# Altium schematic sheet design_11.SchDoc: design
size 414 x 279 mm; Date: 1/25/2021 11:39:22 PM; SheetNumber: 12; Origin: Eagle; GateName_1: G$1; SymbolName_1: A3-L-GUMSTIX; LibraryName: qualified_1; DeviceSetName: A3-L-GUMSTIX; A: A; B: B; C: C; D: D; E: E; F: F; G: G; H: H; 1: 1; 2: 2; 3: 3; 4: 4; 5: 5; Sheet: Sheet:; C:/Gumstix/gumstix-logo-16.bmp: C:/Gumstix/gumstix-logo-16.bmp; Board: Board:
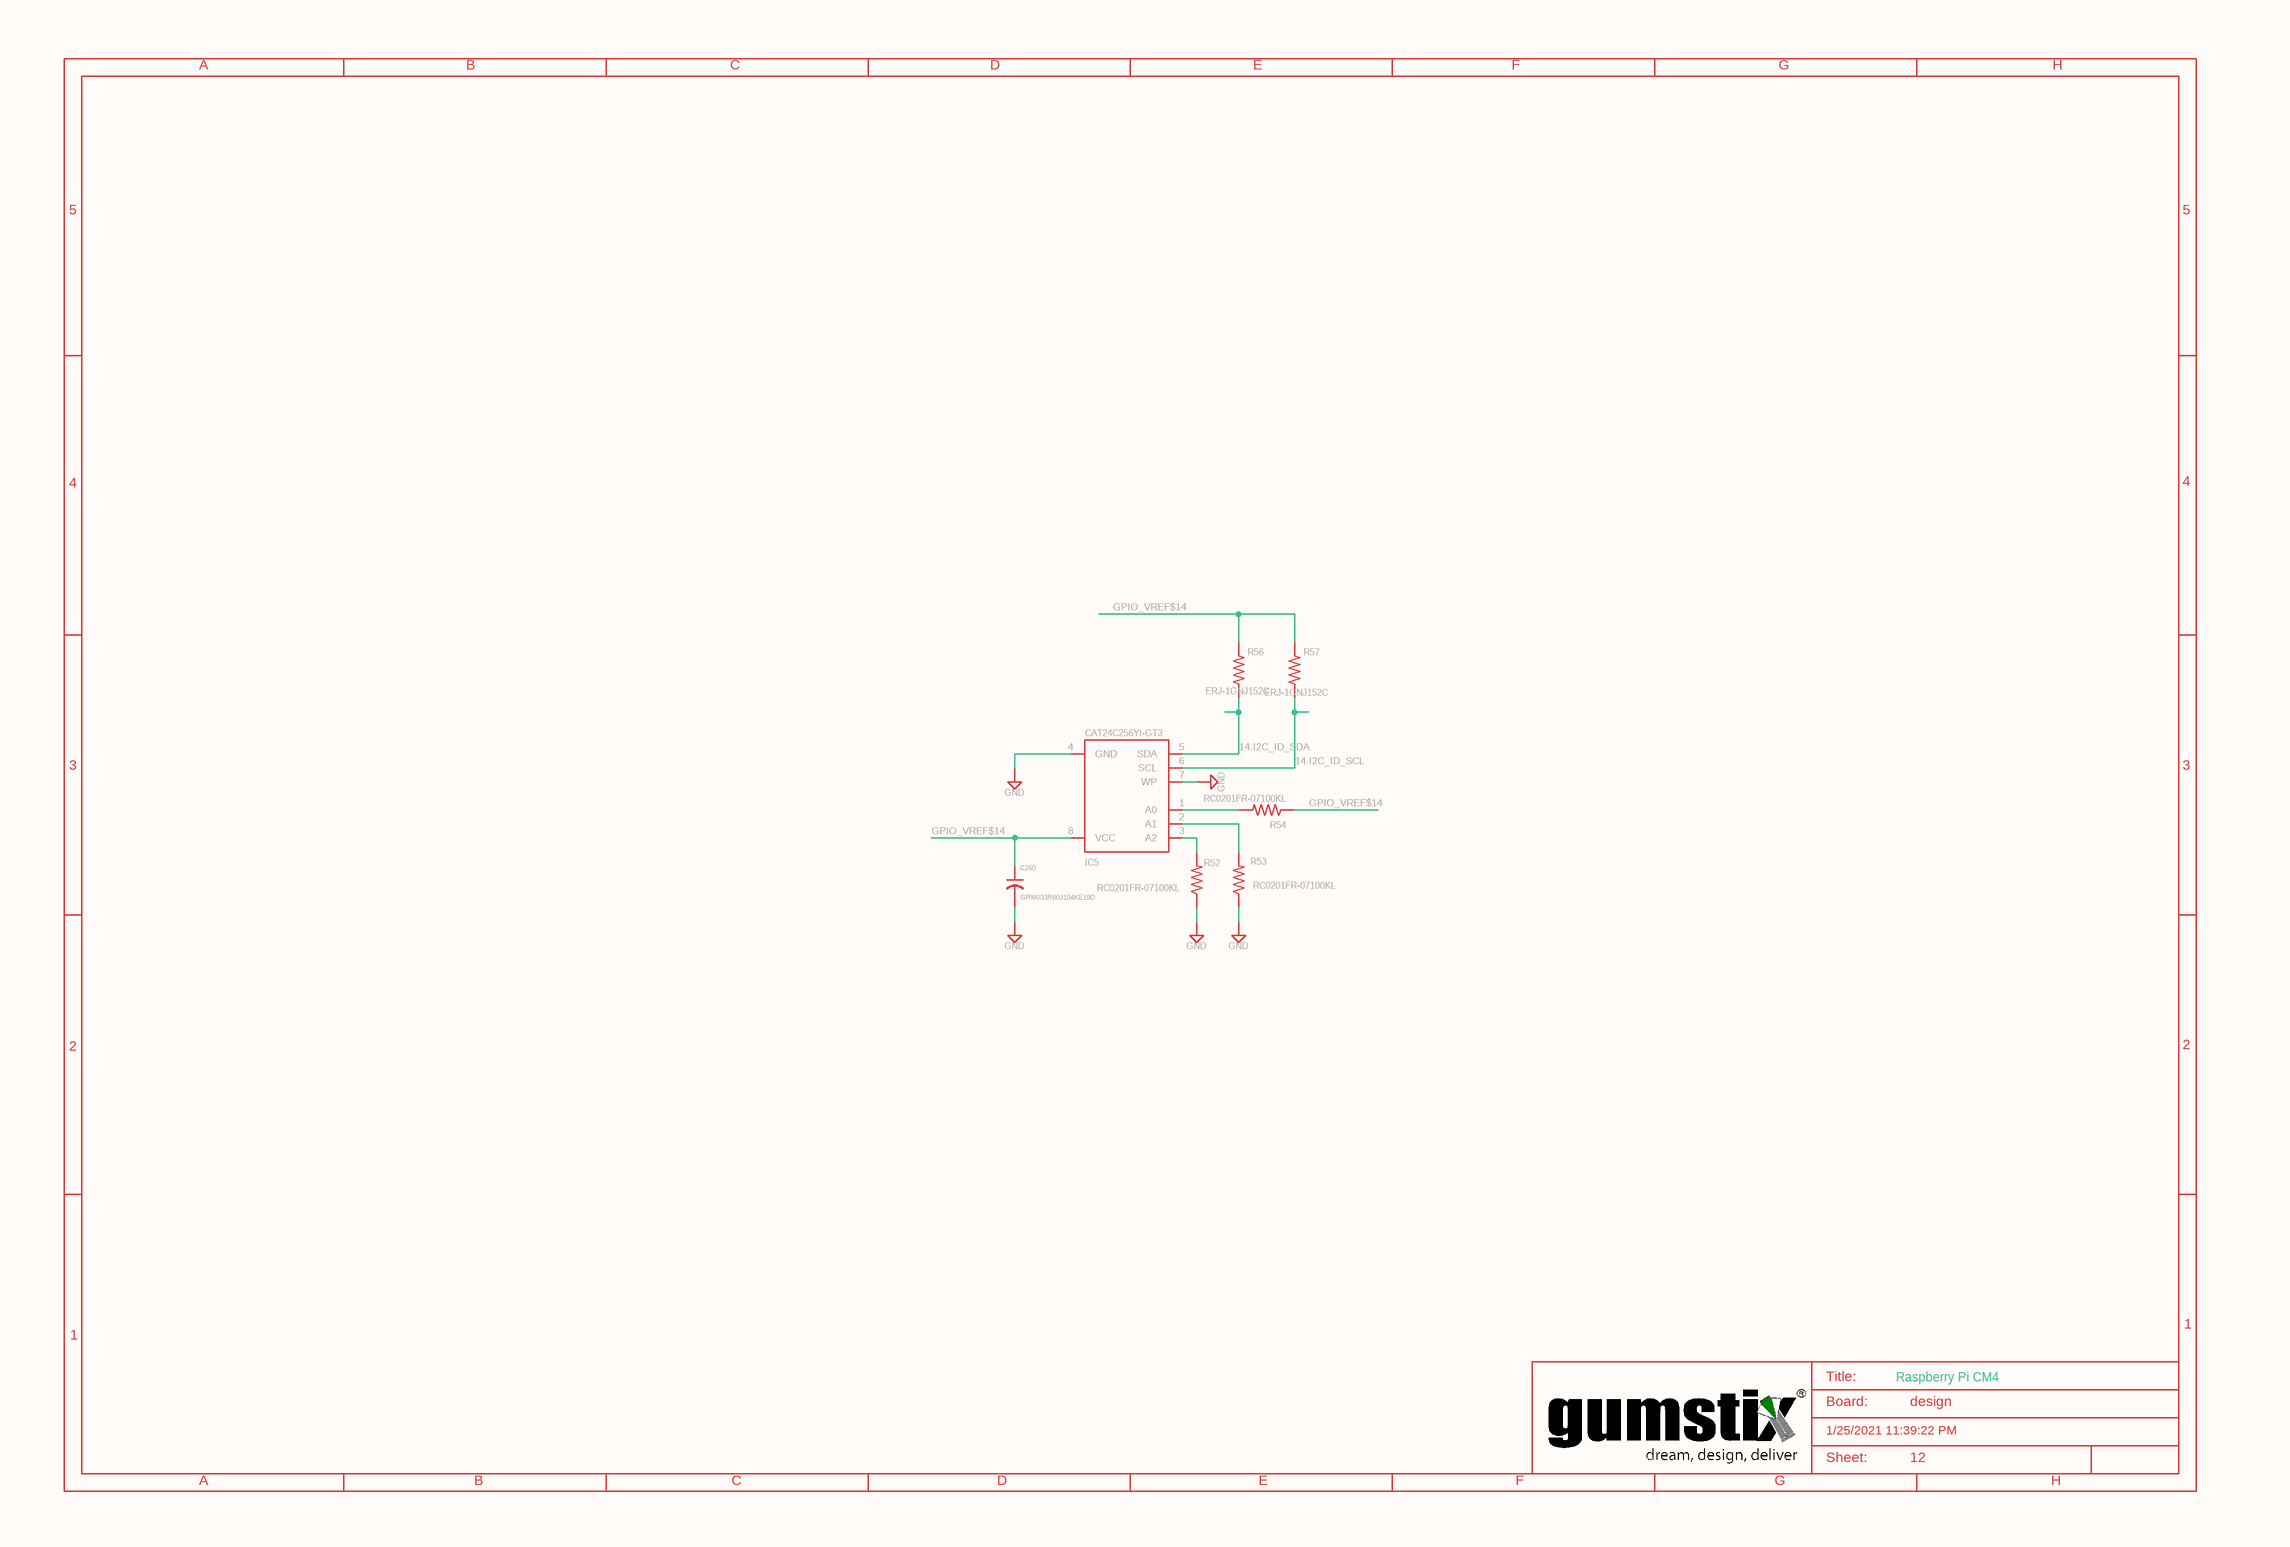
[diagram p0: design_11.SchDoc]

## Parts
C260  GRM033R60J104KE19D  [0201]
IC5  CAT24C256YI-GT3  [TSSOP8]
R52  RC0201FR-07100KL  [0201]
R53  RC0201FR-07100KL  [0201]
R54  RC0201FR-07100KL  [0201]
R56  ERJ-1GNJ152C  [0201]
R57  ERJ-1GNJ152C  [0201]
SUPPLY123  GND
SUPPLY124  GND
SUPPLY125  GND
SUPPLY128  GND
SUPPLY129  GND

## Nets
14.I2C_ID_SCL: IC5.6(SCL) R57.1
14.I2C_ID_SDA: IC5.5(SDA) R56.1
GPIO_VREF$14: C260.1 IC5.8(VCC) R54.1 R56.2 R57.2
NetC260_2: C260.2 SUPPLY124.?1(GND)
NetIC5_1: IC5.1(A0) R54.2
NetIC5_2: IC5.2(A1) R53.2
NetIC5_3: IC5.3(A2) R52.2
NetIC5_4: IC5.4(GND) SUPPLY128.?1(GND)
NetIC5_7: IC5.7(WP) SUPPLY129.?1(GND)
NetR52_1: R52.1 SUPPLY123.?1(GND)
NetR53_1: R53.1 SUPPLY125.?1(GND)

## Notes on the sheet
- A
- B
- C
- D
- E
- F
- G
- H
- 5
- 4
- 3
- 2
- 1
- Title:
- Board:
- Raspberry Pi CM4
- design
- C:/Gumstix/gumstix-logo-16.bmp
- 1/25/2021 11:39:22 PM
- Sheet:
- 12

## Library data of the parts
C260 = GRM033R60J104KE19D: GateName_1: G$1; SymbolName_1: C-US; LibraryName: qualified_1@eagle_src_repo_23ecad3ae72028015427fba7d2ea5a80aee78817; DeviceSetName: GRM033R60J104KE19D; HEIGHT: 0.25
IC5 = CAT24C256YI-GT3: 2-wire serial EEPROM; GateName_1: G$1; SymbolName_1: 24CXX; LibraryName: qualified_1; DeviceSetName: CAT24C256YI-GT3; HEIGHT: 1
R52-R54 = RC0201FR-07100KL: GateName_1: G$1; SymbolName_1: R-US; LibraryName: qualified_1; DeviceSetName: RC0201FR-07100KL; HEIGHT: 0.25
R56 R57 = ERJ-1GNJ152C: GateName_1: G$1; SymbolName_1: R-US; LibraryName: qualified_1; DeviceSetName: ERJ-1GNJ152C; HEIGHT: 0.25
SUPPLY123-SUPPLY125 SUPPLY128 SUPPLY129 = GND: SUPPLY SYMBOL; GateName_1: GND; SymbolName_1: GND; LibraryName: supply2; DeviceSetName: GND